# EasyEDA schematic Auto-tune-FM-reciever-1.00.json
TITLE: Sheet_1; REV: 1.0; Date: 2024-02-21; Sheet: 1/1; Company: Your Company
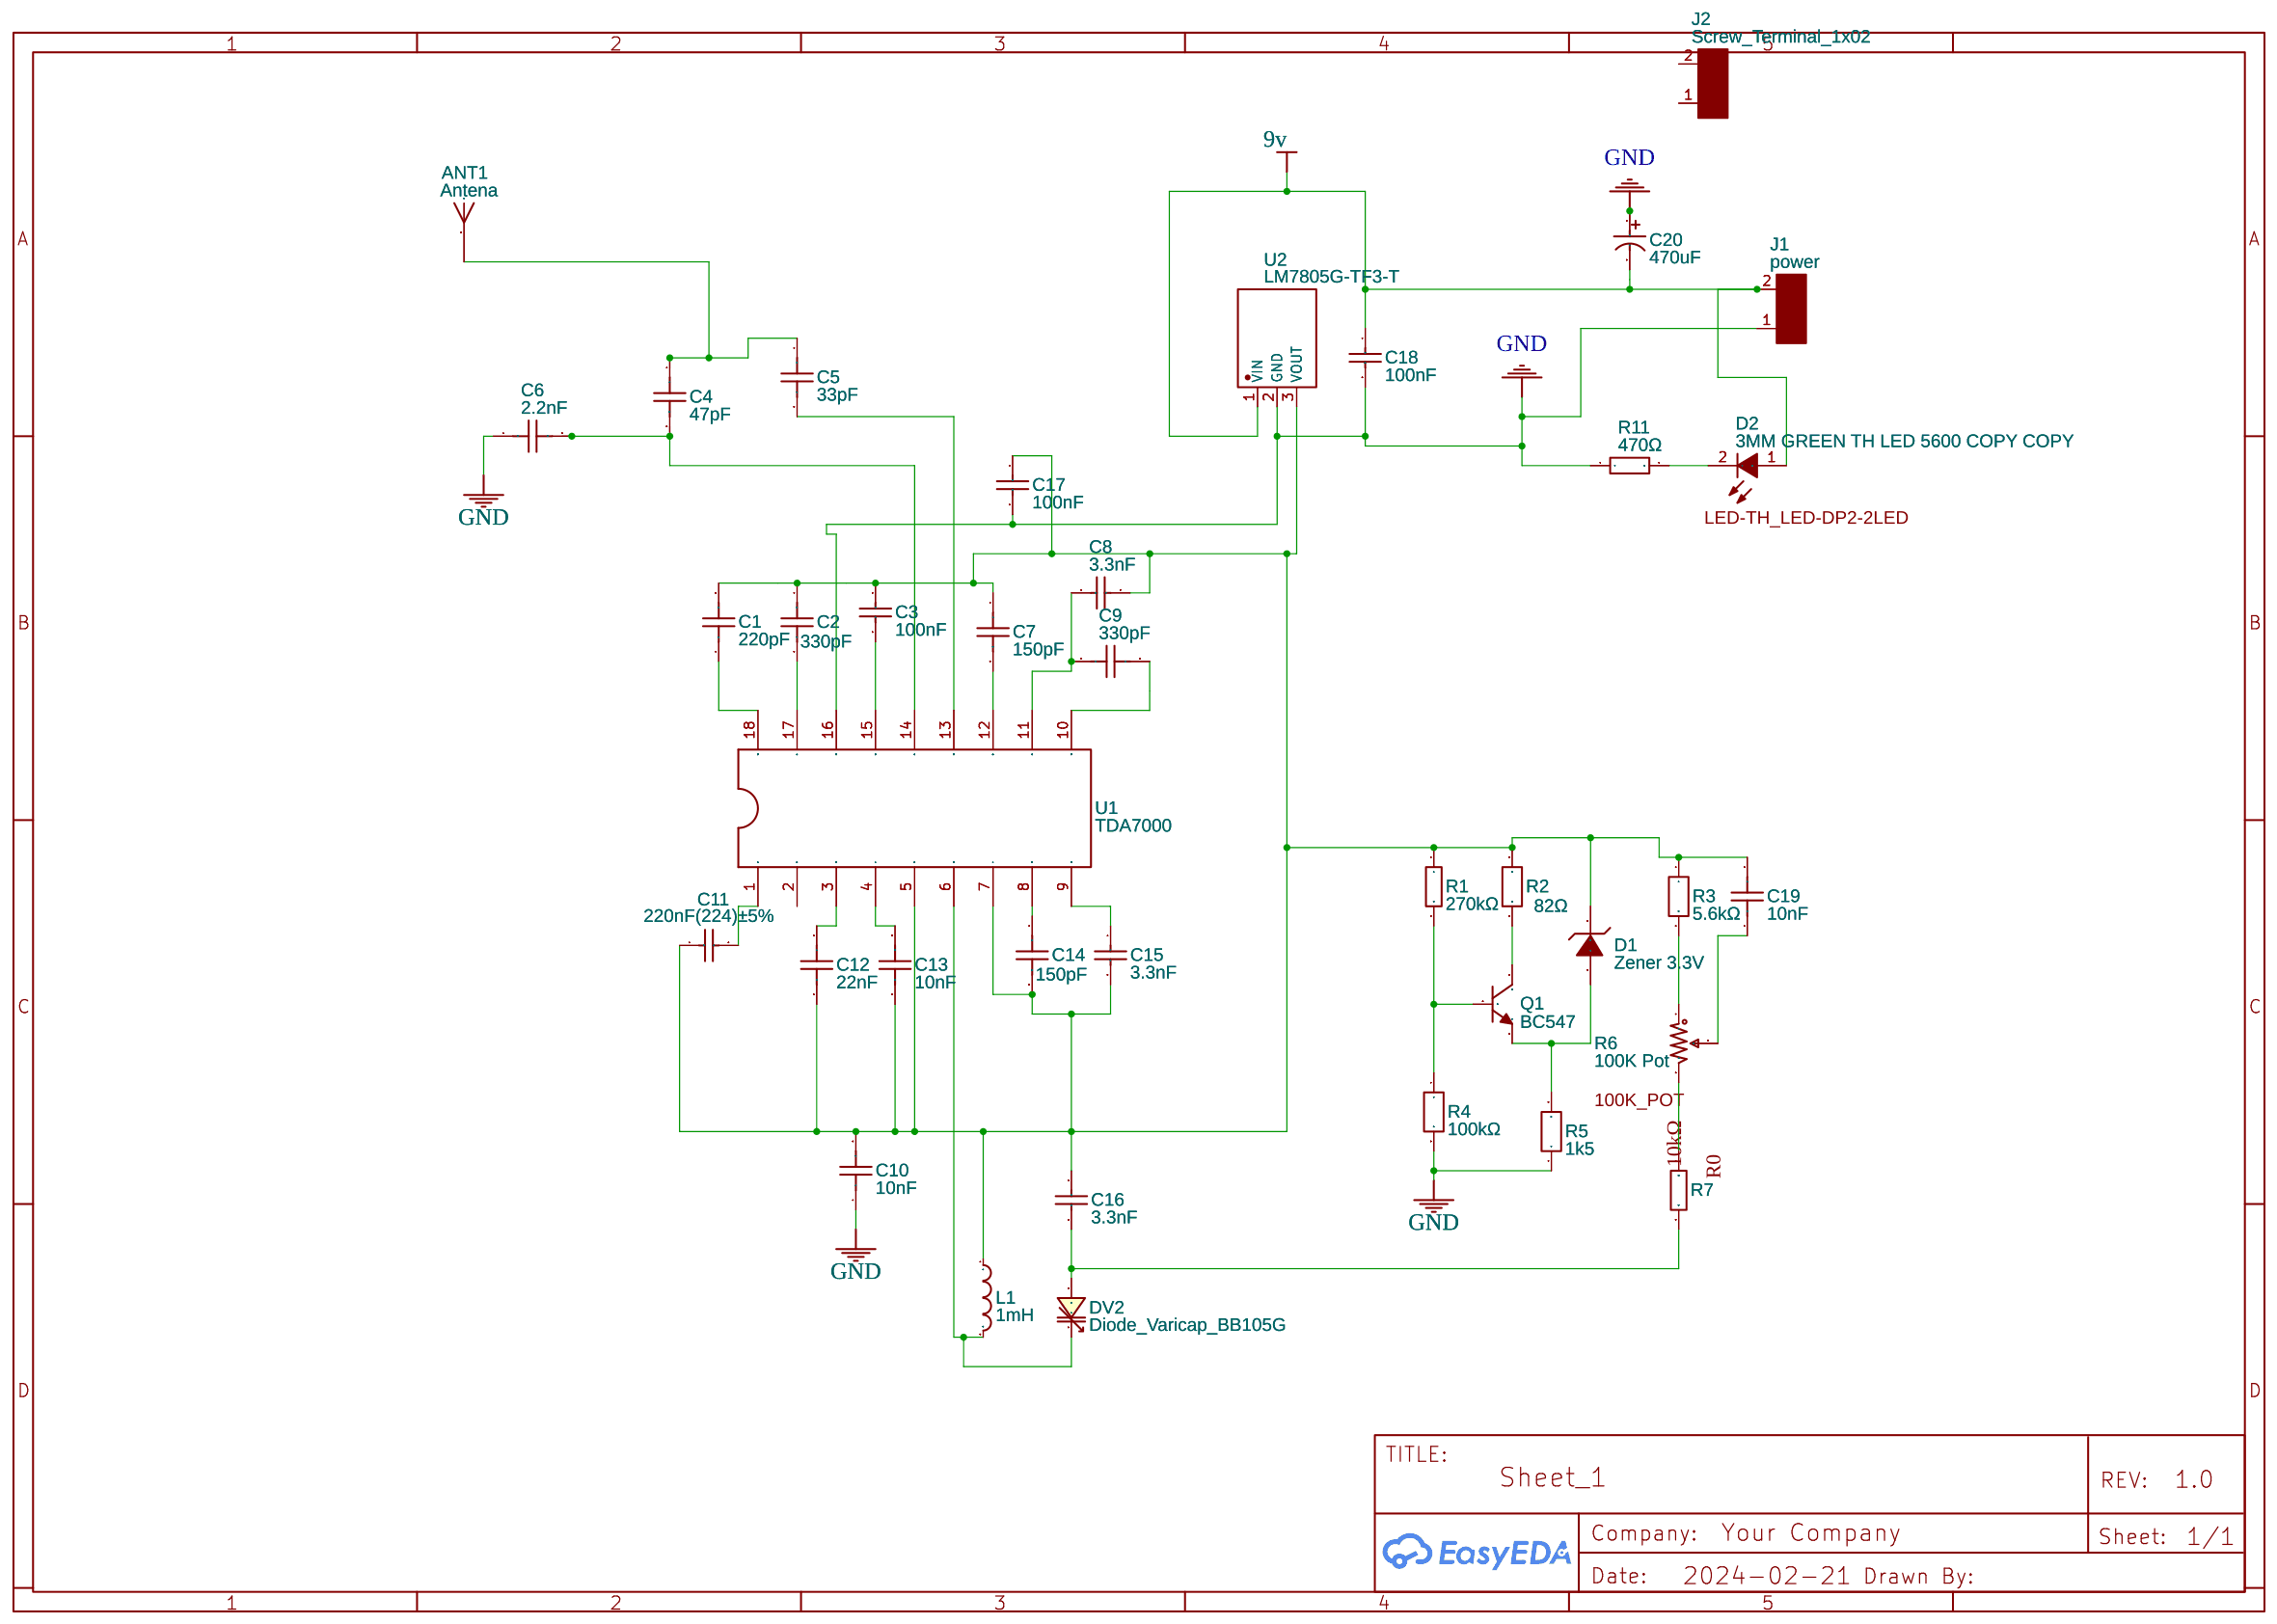
[diagram p0: schematic sheet]

## Parts
ANT1  Antena  [ANTENA_1P]
C1  220pF  [CAP-TH_L6.5-W5.0-P5.00-D1.2]
C2  330pF  [CAP-TH_L4.9-W3.7-P5.08-D0.5]
C3  100nF  [CAP-TH_L4.9-W3.7-P5.08-D0.5]
C4  47pF  [CAP-TH_L4.8-W3.2-P5.08-D0.5]
C5  33pF  [CAP-TH_L4.8-W3.2-P5.08-D0.5]
C6  2.2nF  [CAP-TH_L10.0-W5.0-P7.50-D0.6]
C7  150pF  [CAP-TH_L4.9-W3.7-P2.54-D0.5]
C8  3.3nF  [RAD-0.1]
C9  330pF  [CAP-TH_L4.9-W3.7-P5.08-D0.5]
C10  10nF  [CAPACITOR 10NF #2]
C11  220nF(224)±5%  [CAP-TH_L16.0-W5.5-P15.00-D1.2]
C12  22nF  [CAPACITOR 22NF #7]
C13  10nF  [CAPACITOR 10NF #2]
C14  150pF  [CAP-TH_L4.9-W3.7-P2.54-D0.5]
C15  3.3nF  [RAD-0.1]
C16  3.3nF  [RAD-0.1]
C17  100nF  [CAP-TH_L4.9-W3.7-P5.08-D0.5]
C18  100nF  [CAP-TH_L4.9-W3.7-P5.08-D0.5]
C19  10nF  [CAPACITOR 10NF #2]
C20  470uF  [470UF 16V AMIR]
D1  Zener 3.3V  [ZENER_3.3V]
D2  3MM GREEN TH LED 5600 COPY COPY  [LED-TH_LED-DP2-2LED]
DV2  Diode_Varicap_BB105G  [DIODE_VARICAP_BB105G]
J1  power
J2  Screw_Terminal_1x02
L1  1mH  [IND-TH_BD5.0-L10.5-P14.50-D0.6]
Q1  BC547  [TO-92-3_L4.5-W3.5-P1.27-L]
R1  270kΩ  [RES-TH_BD5.0-L15.5-P19.50-D0.7]
R2  82Ω  [RES-TH_BD5.6-L13.1-P17.10-D1.0]
R3  5.6kΩ  [RES-TH_BD5.6-L13.1-P17.10-D1.0]
R4  100kΩ  [AXIAL RESISTOR 100K OHM - TH_BD2.3-L6.0-P10.00-D0.4]
R5  1k5  [1K5 RESISTOR]
R6  100K Pot  [100K_POT]
R7  Resistor 10KΩ  [RESISTOR 10KΩ]
R11  470Ω  [RES-TH_BD2.4-L6.3-P10.30-D0.6]
U1  TDA7000  [TDA7000]
U2  LM7805G-TF3-T  [TO-220F-3_L10.2-W4.7-P2.54-L]

## Library data of the parts
ANT1 = Antena: Contributor: kylevaughan; Mounted: Yes; Manufacturer Part: ?
C1 = CT81N5Y5P1B221KSE: Contributor: LCSC; Supplier: LCSC; Supplier Part: C190532; Manufacturer: FH(风华); JLCPCB Part Class: Extended Part; Package Display: No
C2 C9 = CC4-0805-CG-100V-330PF-J: Contributor: LCSC; Supplier: LCSC; Supplier Part: C454432; Manufacturer: TORCH(火炬); Manufacturer Part: CC4-0805-CG-100V-330pF-J; JLCPCB Part Class: Extended Part; Package Display: No
C3 C17 C18 = 100nF: Supplier: LCSC; Manufacturer: null; Manufacturer Part: 0.1UF(104) +-20% 63v; Supplier Part: C19355; JLCPCB Part Class: Extended Part; Package Display: No
C4 = CC4-0805-CG -50V-47pF-J: Contributor: LCSC; Supplier: LCSC; Supplier Part: C123159; Manufacturer: TORCH(火炬); Manufacturer Part: CC4-0805-CG-50V-47pF-J; JLCPCB Part Class: Extended Part; Package Display: No
C5 = CC4-0805-CG -50V-33pF-J: Contributor: LCSC; Supplier: LCSC; Supplier Part: C123153; Manufacturer: TORCH(火炬); Manufacturer Part: CC4-0805-CG-50V-33pF-J; JLCPCB Part Class: Extended Part; Package Display: No
C6 = CY1222ME1IEF47M0A2: Contributor: LCSC; Supplier: LCSC; Supplier Part: C263246; Manufacturer: Dersonic(德尔创); JLCPCB Part Class: Extended Part; Package Display: No
C7 C14 = CC4-0805-CG-100V-150PF-J-L: Contributor: LCSC; Supplier: LCSC; Supplier Part: C454400; Manufacturer: TORCH(火炬); Manufacturer Part: CC4-0805-CG-100V-150pF-J-L; JLCPCB Part Class: Extended Part; Package Display: No
C8 C15 C16 = 3.3nF: Supplier: LCSC; Manufacturer: LCSC; Manufacturer Part: 332Z-50V-CCC; Supplier Part: C3746; Package Display: No
C10 C13 C19 = Capacitor 10nF #2: Supplier: LCSC; Supplier Part: C156259; Manufacturer: WIMA; Manufacturer Part: MKS2C022201A00MSSD; Contributor: Benumb; Package Display: No
C11 = CBBCapacitor 224J/630V: Supplier: LCSC; Manufacturer: ValuePro; Supplier Part: C66961; Package Display: No
C12 = Capacitor 22nF #7: Supplier: LCSC; Supplier Part: C156259; Manufacturer: WIMA; Manufacturer Part: MKS2C022201A00MSSD; Contributor: Benumb; Package Display: No
C20 = 470UF16V: Supplier: LCSC; Manufacturer: ValuePro; Manufacturer Part: 470uf16v; Supplier Part: C28067; Package Display: No
D1 = Z7.5-CKD-3.3V@5MA: Supplier: LCSC; Supplier Part: C9900018130; Manufacturer: null; Manufacturer Part: Z7.5-CKD-3.3V@5mA; JLCPCB Part Class: Extended Part; Contributor: mirko.hennel; Package Display: No
D2 = 3MM GREEN TH LED 5600 COPY COPY: Supplier: Digi-Key; Manufacturer: VccLite; Manufacturer Part: 5600; Supplier Part: L20325-ND; link: https://vcclite.com/product/5602f5-5v/; Contributor: AlexKatsovich; Package Display: Yes
DV2 = Diode_Varicap_BB105G: High Conductance Fast Diode; Contributor: tontondadou; Package Display: No
J1 J2 = Screw_Terminal_1x02: Contributor: KiCAD; license: https://www.gnu.org/licenses/lgpl-2.1.html
L1 = CKL0510-1MH/K-A-0.252MHZ T: Contributor: LCSC; Supplier: LCSC; Supplier Part: C354679; Manufacturer: CENKER(岑科); Manufacturer Part: CKL0510-1mH/K-A-0.252MHz T; JLCPCB Part Class: Extended Part; Package Display: No
Q1 = BC547: Contributor: LCSC; Supplier: LCSC; Supplier Part: C2910381; Manufacturer: CJ(江苏长电/长晶); JLCPCB Part Class: Extended Part
R1 = MF3WS-270KΩ±1% T: Contributor: LCSC; Supplier: LCSC; Supplier Part: C119760; Manufacturer: CCO(千志电子); JLCPCB Part Class: Extended Part; Package Display: No
R2 = 23J82RE: Contributor: lcsc; Supplier: LCSC; Supplier Part: C3532084; Manufacturer: Ohmite; Package Display: No
R3 = 23J5K6E: Contributor: lcsc; Supplier: LCSC; Supplier Part: C3542006; Manufacturer: Ohmite; Package Display: No
R4 = AXIAL RESISTOR 100K OHM - TH_BD2.3-L6.0-P10.00-D0.4: Contributor: Waleed Kies; JLCPCB Part Class: Extended Part; Package Display: No
R5 = R_0603_EU: Contributor: jurjenspan120; Package Display: No
R6 = 100K Pot: Manufacturer: Amazon; Supplier Part: Uxcell a15040700ux0373; Contributor: gdc14910; Package Display: Yes
R7 = Resistor 10KΩ: Manufacturer Part: Resistor 10kΩ; Contributor: IVI1; Package Display: No
R11 = MFR-25JT-52-470R: Contributor: LCSC; Supplier: LCSC; Supplier Part: C176518; Manufacturer: YAGEO(国巨); JLCPCB Part Class: Extended Part; Package Display: No
U1 = TDA7000: Contributor: ivokovacic
U2 = LM7805G-TF3-T: Contributor: LCSC; Supplier: LCSC; Supplier Part: C213490; Manufacturer: UTC(友顺); JLCPCB Part Class: Extended Part; Package Display: No

## Nets
9v: C18.1 C20.2 D2.1(A) J1.2 U2.1(VIN)
GND: C6.1 C10.1 C17.2 C18.2 C20.1 J1.1 R4.2 R5.1 R11.1 U1.16 U2.2(GND)
Net-(ANT1-1): ANT1.1 C4.1 C5.1
Net-(C1-1): C1.1 U1.18
Net-(C1-2): C1.2 C2.1 C3.1 C7.1 C8.2 C10.2 C11.1 C12.1 C13.1 C14.2 C15.2 C16.1 C17.1 C19.2 D1.2(K) L1.1 R1.1 R2.1 R3.1 U1.5 U1.7 U2.3(VOUT)
Net-(C2-2): C2.2 U1.17
Net-(C3-2): C3.2 U1.15
Net-(C4-2): C4.2 C6.2 U1.14
Net-(C5-2): C5.2 U1.13
Net-(C7-2): C7.2 U1.12
Net-(C8-1): C8.1 C9.1 U1.11
Net-(C9-2): C9.2 U1.10
Net-(C11-2): C11.2 U1.1
Net-(C12-2): C12.2 U1.3
Net-(C13-2): C13.2 U1.4
Net-(C14-1): C14.1 U1.8
Net-(C15-1): C15.1 U1.9
Net-(C16-2): C16.2 DV2.1(A) R7.2(0)
Net-(C19-1): C19.1 R6.2
Net-(D1-1): D1.1(A) Q1.3(E) R5.2
Net-(D2-2): D2.2(K) R11.2
Net-(DV2-2): DV2.2(K) L1.2 U1.6
Net-(Q1-1): Q1.1(C) R2.2
Net-(Q1-2): Q1.2(B) R1.2 R4.1
Net-(R3-2): R3.2 R6.1
Net-(R6-3): R6.3 R7.1(0)

Not connected (* = marked no-connect by the designer): J2 1 2; U1 2
